# Altium schematic sheet RS485.SchDoc
size 297 x 209 mm; SheetNumber: 11; SheetTotal: 29
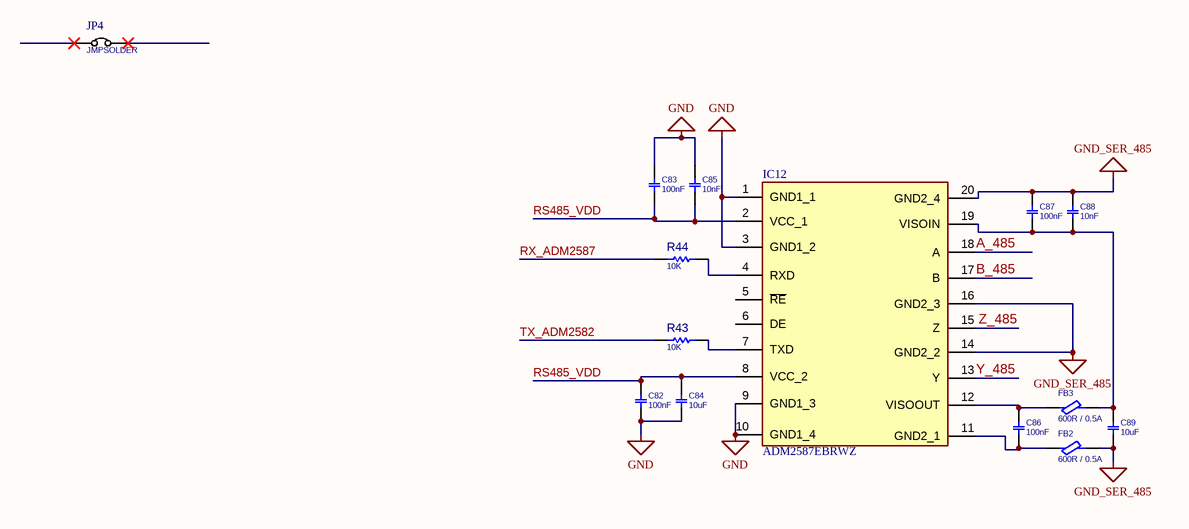
[diagram p0: RS485.SchDoc]

## Parts
C82  100nF  [C0603]
C83  100nF  [C0603]
C84  10uF  [C0603]
C85  10nF  [C0603]
C86  100nF  [C0603]
C87  100nF  [C0603]
C88  10nF  [C0603]
C89  10uF  [C0603]
FB2  600R / 0.5A  [L0603]
FB3  600R / 0.5A  [L0603]
IC12  ADM2587EBRWZ  [SOIC127P1032X265-20N]
JP4  JMPSOLDER  [JP_40X50]
R43  10K  [R0805]
R44  10K  [R0805]

## Nets
GND: C82.1 C83.2 C84.2 C85.1 IC12.1(GND1_1) IC12.3(GND1_2) IC12.9(GND1_3) IC12.10(GND1_4)
GND_SER_485: C87.2 C88.1 C89.1 FB2.2 IC12.14(GND2_2) IC12.16(GND2_3) IC12.20(GND2_4)
A_485: IC12.18(A)
B_485: IC12.17(B)
RS485_VDD: C82.2 C83.1 C84.1 C85.2 IC12.2(VCC_1) IC12.8(VCC_2)
RX_ADM2587: R44.1
TX_ADM2582: R43.1
Y_485: IC12.13(Y)
Z_485: IC12.15(Z)
NetC86_1: C86.1 FB2.1 IC12.11(GND2_1)
NetC86_2: C86.2 FB3.1 IC12.12(VISOOUT)
NetC87_1: C87.1 C88.2 C89.2 FB3.2 IC12.19(VISOIN)
NetIC12_4: IC12.4(RXD) R44.2
NetIC12_7: IC12.7(TXD) R43.2

Not connected (* = marked no-connect by the designer): IC12 5(~{RE}) 6(DE); JP4 1* 2*

## Notes on the sheet
- Drawn
- Name
- Date
- Drawing Title
- Checked
- Drawing No.
- Approved
- Size
- A4
- Ver.
- Rev.
- Sheet
- Of

## Library data of the parts
C82-C89 = CAP_SMD_MLCC_10u25V_0603: CAP, MLCC; MANF_P#: GRM188R61E106KA73; MANF: Murata; PARAM: X5R, 10%; PARAM2: 25V; PRICE: 100=15$
  C82 C83 C86 C87: VALUE: 100nF
  C84 C89: VALUE: 10uF
  C85 C88: VALUE: 10nF
FB2 FB3 = FBEAD_SMD_MPZ1608S102: FERRITE_Bead, 0603, 0.8A, 300mOhm, 1000@100MHz; MANF: TDK; MANF_P#: MPZ1608S102ATA00; PARAM: 1000@100MHz; PARAM2: 0.8A; PRICE: 100= 3.4$; VALUE: 600R / 0.5A
IC12 = ADM2587EBRWZ: Integrated Circuit; Manufacturer_Name: Analog Devices; Datasheet Link: http://www.analog.com/static/imported-files/data_sheets/ADM2582E_2587E.pdf; Height: 2.65mm; Manufacturer_Part_Number: ADM2587EBRWZ; Mouser Part Number: 584-ADM2587EBRWZ; Mouser Price/Stock: https://www.mouser.co.uk/ProductDetail/Analog-Devices/ADM2587EBRWZ?qs=BpaRKvA4VqEzsBsna6VmlA%3D%3D; Arrow Part Number: ADM2587EBRWZ; Arrow Price/Stock: https://www.arrow.com/en/products/adm2587ebrwz/analog-devices?region=nac
JP4 = JUMPER_SOLDER: JUMPER, HEADER 2PIN; MANF: MANF; MANF_P#: MANF_P#; VALUE: JMPSOLDER
R43 R44 = RES_SMD_0805: RESISTOR, SMD; PARAM: -W; DESC: DESCRIPTION; DIST#: MOUSER; PARAM2: 1%; MANF_P#: -; MANF: -; ASSEMBLY: ASSEMBLY; PRICE: 100= 0.5$; VALUE: 10K